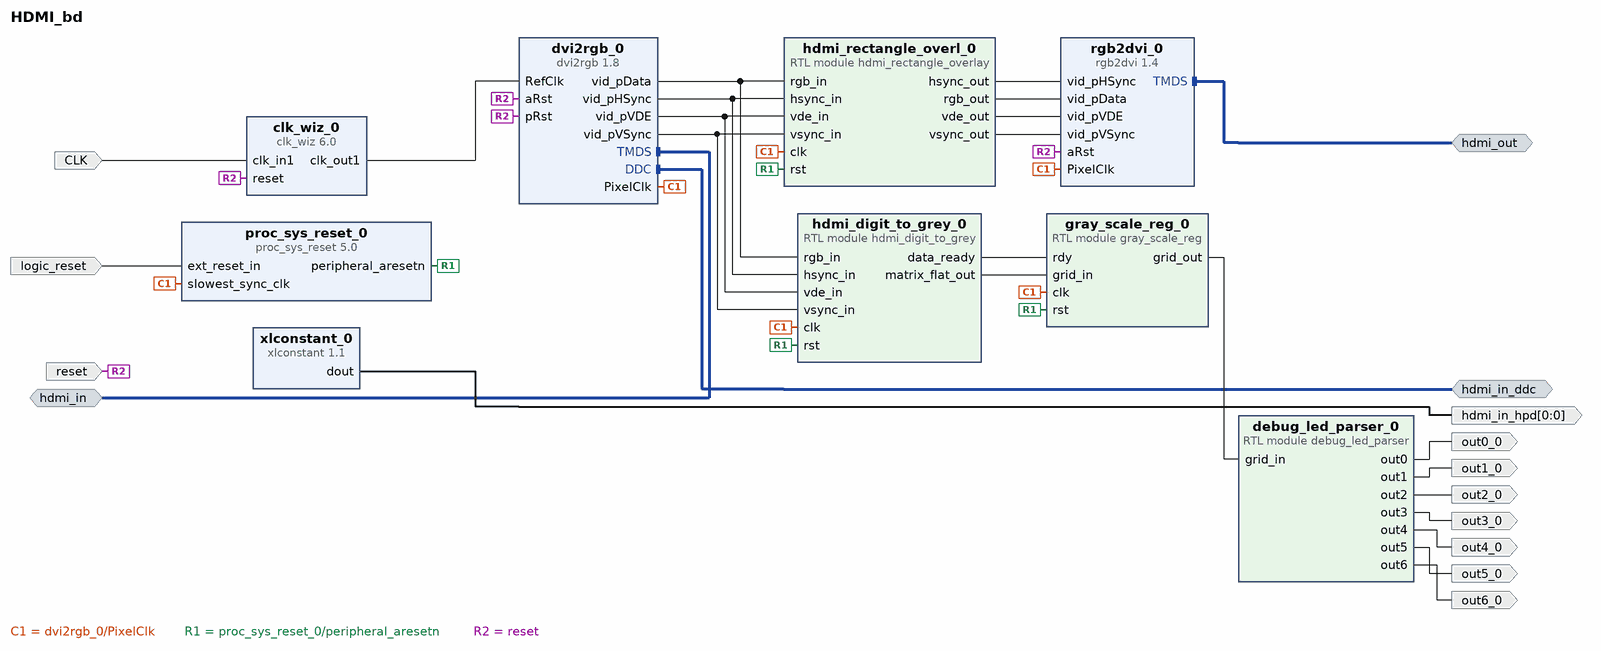
[diagram p0: block diagram of the top level]
# Vivado block design HDMI_bd, xc7z020clg400-1, Vivado 2023.1
create_bd_design HDMI_bd

create_bd_intf_port -mode Slave -vlnv digilentinc.com:interface:tmds_rtl:1.0 hdmi_in
create_bd_intf_port -mode Master -vlnv xilinx.com:interface:iic_rtl:1.0 hdmi_in_ddc
create_bd_intf_port -mode Master -vlnv digilentinc.com:interface:tmds_rtl:1.0 hdmi_out
create_bd_port -dir I -type clk CLK
set_property -dict {CONFIG.FREQ_HZ 125000000} [get_bd_ports CLK]
create_bd_port -dir I -type rst reset
set_property -dict {CONFIG.POLARITY ACTIVE_HIGH} [get_bd_ports reset]
create_bd_port -dir O -from 0 -to 0 hdmi_in_hpd
create_bd_port -dir I logic_reset
create_bd_port -dir O out0_0
create_bd_port -dir O out1_0
create_bd_port -dir O out2_0
create_bd_port -dir O out3_0
create_bd_port -dir O out4_0
create_bd_port -dir O out5_0
create_bd_port -dir O out6_0

create_bd_cell -type ip -vlnv xilinx.com:ip:clk_wiz:6.0 clk_wiz_0
set_property -dict [list \
  CONFIG.CLKIN1_JITTER_PS 80.0 \
  CONFIG.CLKOUT1_DRIVES BUFG \
  CONFIG.CLKOUT1_JITTER 109.241 \
  CONFIG.CLKOUT1_PHASE_ERROR 96.948 \
  CONFIG.CLKOUT1_REQUESTED_OUT_FREQ 200.000 \
  CONFIG.CLKOUT2_DRIVES BUFG \
  CONFIG.CLKOUT3_DRIVES BUFG \
  CONFIG.CLKOUT4_DRIVES BUFG \
  CONFIG.CLKOUT5_DRIVES BUFG \
  CONFIG.CLKOUT6_DRIVES BUFG \
  CONFIG.CLKOUT7_DRIVES BUFG \
  CONFIG.MMCM_CLKFBOUT_MULT_F 8 \
  CONFIG.MMCM_CLKIN1_PERIOD 8.000 \
  CONFIG.MMCM_CLKIN2_PERIOD 10.0 \
  CONFIG.MMCM_CLKOUT0_DIVIDE_F 5 \
  CONFIG.MMCM_COMPENSATION ZHOLD \
  CONFIG.MMCM_DIVCLK_DIVIDE 1 \
  CONFIG.PRIMITIVE PLL \
  CONFIG.PRIM_IN_FREQ 125.000 \
] [get_bd_cells clk_wiz_0]
create_bd_cell -type ip -vlnv digilentinc.com:ip:dvi2rgb:1.8 dvi2rgb_0
create_bd_cell -type ip -vlnv digilentinc.com:ip:rgb2dvi:1.4 rgb2dvi_0
set_property -dict {CONFIG.kClkPrimitive MMCM CONFIG.kClkRange 3} [get_bd_cells rgb2dvi_0]
create_bd_cell -type ip -vlnv xilinx.com:ip:xlconstant:1.1 xlconstant_0
create_bd_cell -type ip -vlnv xilinx.com:ip:proc_sys_reset:5.0 proc_sys_reset_0
create_bd_cell -type module -reference hdmi_rectangle_overlay hdmi_rectangle_overl_0
create_bd_cell -type module -reference debug_led_parser debug_led_parser_0
create_bd_cell -type module -reference gray_scale_reg gray_scale_reg_0
create_bd_cell -type module -reference hdmi_digit_to_grey hdmi_digit_to_grey_0

# ---- connections ----

connect_bd_intf_net [get_bd_intf_pins dvi2rgb_0/DDC] [get_bd_intf_ports hdmi_in_ddc]
connect_bd_intf_net [get_bd_intf_pins dvi2rgb_0/TMDS] [get_bd_intf_ports hdmi_in]
connect_bd_intf_net [get_bd_intf_pins rgb2dvi_0/TMDS] [get_bd_intf_ports hdmi_out]
connect_bd_net [get_bd_ports CLK] [get_bd_pins clk_wiz_0/clk_in1]
connect_bd_net [get_bd_pins clk_wiz_0/clk_out1] [get_bd_pins dvi2rgb_0/RefClk]
connect_bd_net [get_bd_pins debug_led_parser_0/out0] [get_bd_ports out0_0]
connect_bd_net [get_bd_pins debug_led_parser_0/out1] [get_bd_ports out1_0]
connect_bd_net [get_bd_pins debug_led_parser_0/out2] [get_bd_ports out2_0]
connect_bd_net [get_bd_pins debug_led_parser_0/out3] [get_bd_ports out3_0]
connect_bd_net [get_bd_pins debug_led_parser_0/out4] [get_bd_ports out4_0]
connect_bd_net [get_bd_pins debug_led_parser_0/out5] [get_bd_ports out5_0]
connect_bd_net [get_bd_pins debug_led_parser_0/out6] [get_bd_ports out6_0]
connect_bd_net [get_bd_pins dvi2rgb_0/PixelClk] \
  [get_bd_pins rgb2dvi_0/PixelClk] [get_bd_pins proc_sys_reset_0/slowest_sync_clk] [get_bd_pins hdmi_rectangle_overl_0/clk] \
  [get_bd_pins gray_scale_reg_0/clk] [get_bd_pins hdmi_digit_to_grey_0/clk]
connect_bd_net [get_bd_pins dvi2rgb_0/vid_pData] [get_bd_pins hdmi_rectangle_overl_0/rgb_in] [get_bd_pins hdmi_digit_to_grey_0/rgb_in]
connect_bd_net [get_bd_pins dvi2rgb_0/vid_pHSync] [get_bd_pins hdmi_rectangle_overl_0/hsync_in] [get_bd_pins hdmi_digit_to_grey_0/hsync_in]
connect_bd_net [get_bd_pins dvi2rgb_0/vid_pVDE] [get_bd_pins hdmi_rectangle_overl_0/vde_in] [get_bd_pins hdmi_digit_to_grey_0/vde_in]
connect_bd_net [get_bd_pins dvi2rgb_0/vid_pVSync] [get_bd_pins hdmi_rectangle_overl_0/vsync_in] [get_bd_pins hdmi_digit_to_grey_0/vsync_in]
connect_bd_net [get_bd_pins gray_scale_reg_0/grid_out] [get_bd_pins debug_led_parser_0/grid_in]
connect_bd_net [get_bd_pins hdmi_digit_to_grey_0/data_ready] [get_bd_pins gray_scale_reg_0/rdy]
connect_bd_net [get_bd_pins hdmi_digit_to_grey_0/matrix_flat_out] [get_bd_pins gray_scale_reg_0/grid_in]
connect_bd_net [get_bd_pins hdmi_rectangle_overl_0/hsync_out] [get_bd_pins rgb2dvi_0/vid_pHSync]
connect_bd_net [get_bd_pins hdmi_rectangle_overl_0/rgb_out] [get_bd_pins rgb2dvi_0/vid_pData]
connect_bd_net [get_bd_pins hdmi_rectangle_overl_0/vde_out] [get_bd_pins rgb2dvi_0/vid_pVDE]
connect_bd_net [get_bd_pins hdmi_rectangle_overl_0/vsync_out] [get_bd_pins rgb2dvi_0/vid_pVSync]
connect_bd_net [get_bd_ports logic_reset] [get_bd_pins proc_sys_reset_0/ext_reset_in]
connect_bd_net [get_bd_pins proc_sys_reset_0/peripheral_aresetn] \
  [get_bd_pins hdmi_rectangle_overl_0/rst] [get_bd_pins gray_scale_reg_0/rst] [get_bd_pins hdmi_digit_to_grey_0/rst]
connect_bd_net [get_bd_ports reset] \
  [get_bd_pins dvi2rgb_0/pRst] [get_bd_pins dvi2rgb_0/aRst] [get_bd_pins clk_wiz_0/reset] [get_bd_pins rgb2dvi_0/aRst]
connect_bd_net [get_bd_pins xlconstant_0/dout] [get_bd_ports hdmi_in_hpd]

validate_bd_design
save_bd_design
